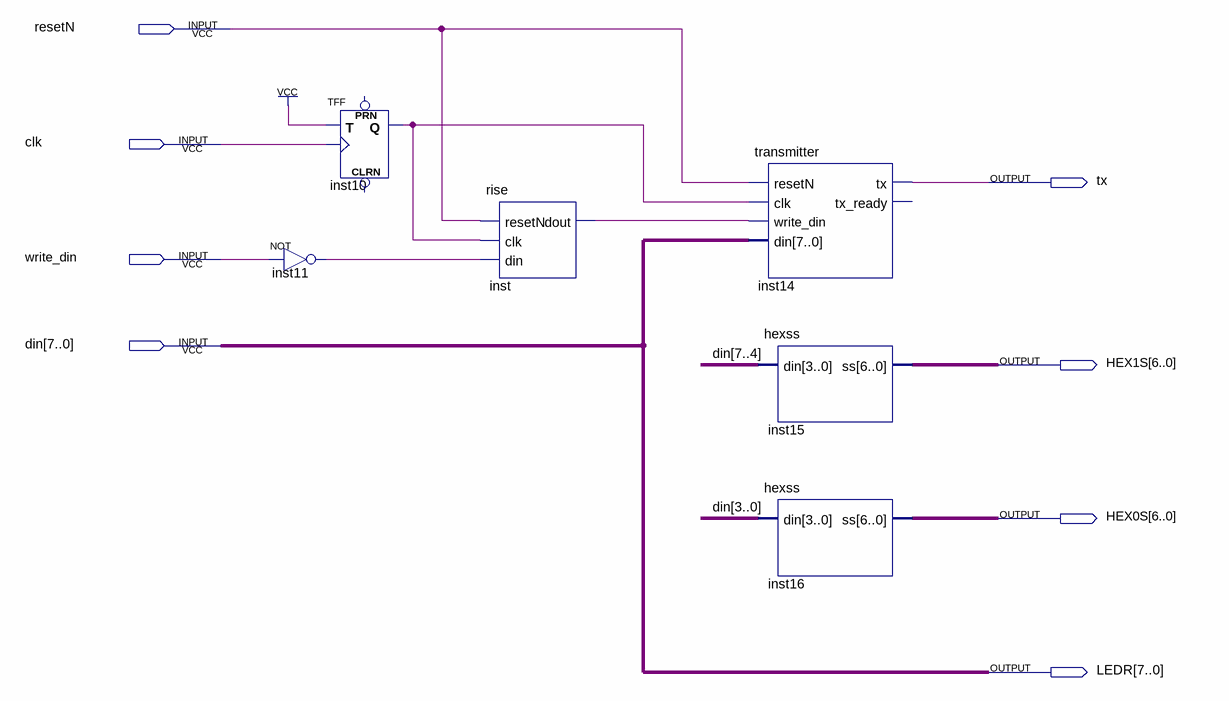
[diagram p0: schematic sheet]
// Quartus schematic test_transmitter.bdf as structural Verilog: 6 symbols, 8 pins
module test_transmitter (
  input  resetN,
  input  clk,
  input  write_din,
  input  [7:0] din,
  output tx,
  output [6:0] HEX1S,
  output [6:0] HEX0S,
  output [7:0] LEDR
);

  wire inst10_q, inst11_out, inst_dout;

  TFF inst10 (.T(1'b1), .CLK(clk), .Q(inst10_q));  // open: PRN, CLRN
  not inst11 (inst11_out, write_din);
  rise inst (.resetN(resetN), .clk(inst10_q), .din(inst11_out), .dout(inst_dout));
  transmitter inst14 (.resetN(resetN), .clk(inst10_q), .write_din(inst_dout), .din(din), .tx(tx));  // open: tx_ready
  hexss inst15 (.din(din[7:4]), .ss(HEX1S));
  hexss inst16 (.din(din[3:0]), .ss(HEX0S));

  assign LEDR = din;
endmodule
